# Altium project Segger_TypeC_DebugBoard_v1.PrjPcb
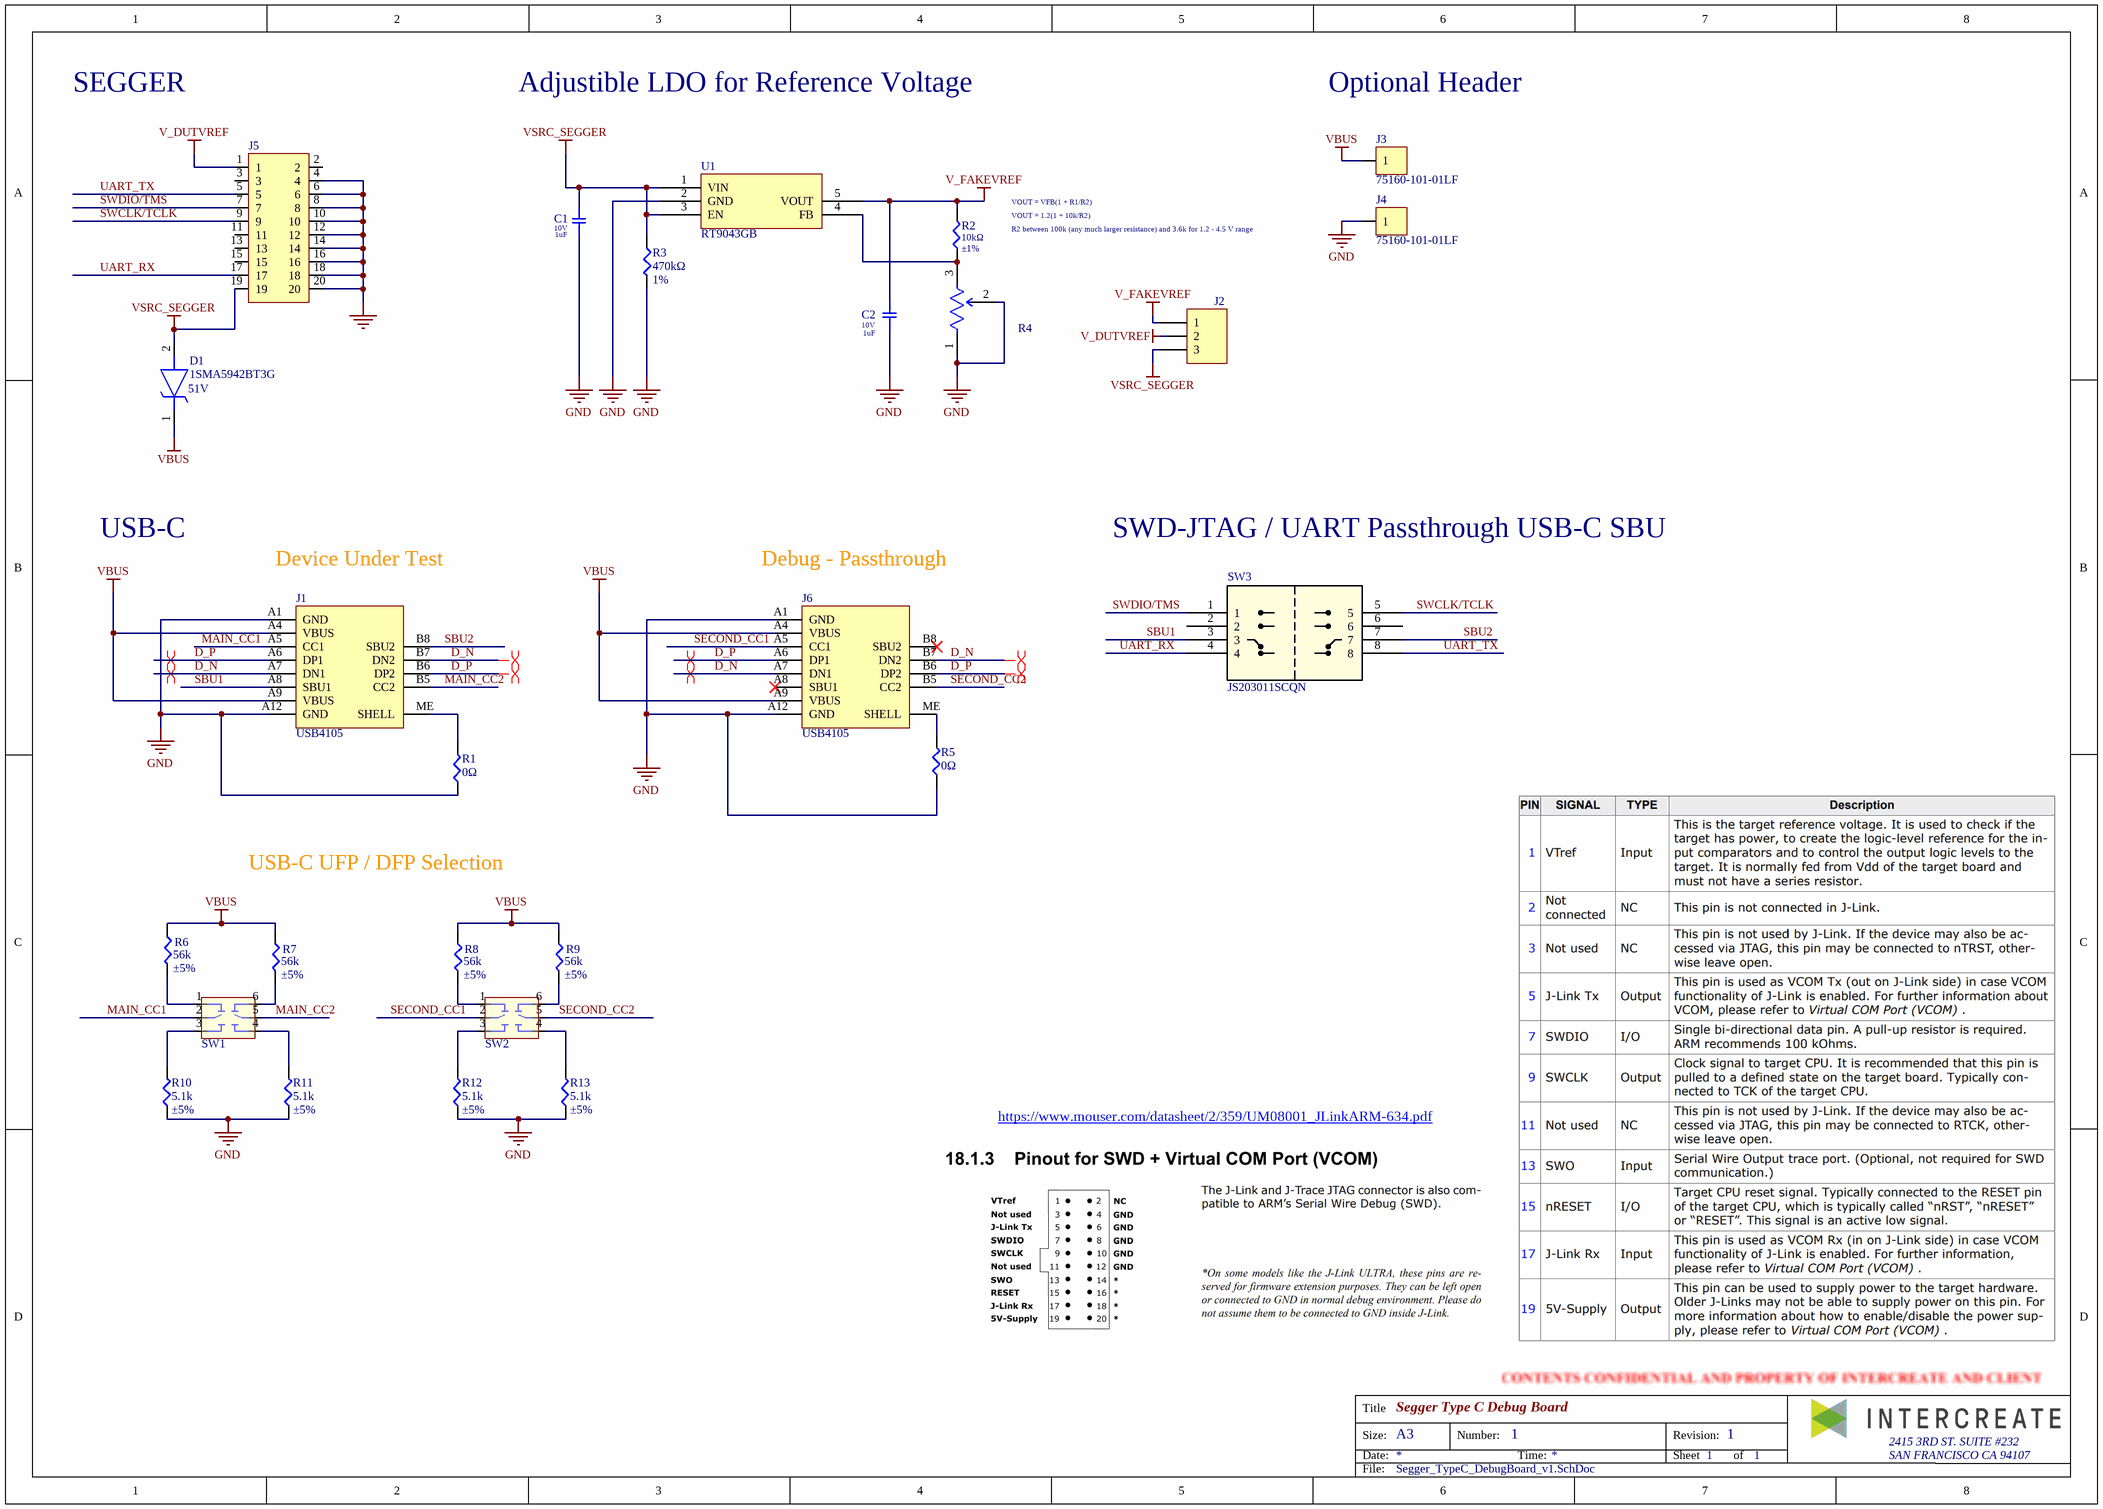
[diagram p0: Segger_TypeC_DebugBoard_v1.SchDoc]
Rev: 1; ProjectName: Segger Type C Debug Board
1 sheet, 26 parts. Net scope: global (net labels, ports and power ports of the same name join across sheets).
Board file: Segger_TypeC_DebugBoard_v1.PcbDoc

## Sheet Segger_TypeC_DebugBoard_v1.SchDoc: Segger Type C Debug Board
size A3; Organization: INTERCREATE; Address1: 2415 3RD ST. SUITE #232; Address2: SAN FRANCISCO CA 94107; DocumentNumber: 1; Revision: 1; SheetNumber: 1; SheetTotal: 1; ProjectName: KAGWERKS COMMAND CENTER

### Parts
C1  Voltage Rating: 10V  Capacitance: 1uF  [CAP-0402]  (hidden comment: 0402ZD105KAT2A)
C2  Voltage Rating: 10V  Capacitance: 1uF  [CAP-0402]  (hidden comment: 0402ZD105KAT2A)
D1  1SMA5942BT3G  Zener Voltage: 51V  [DIODE-SMA2]
J1  USB4105  [CONN-USBC-GCT_USB4105]
J2  61300311121  [HDR-V-1X3]  (value not drawn)
J3  75160-101-01LF  [HDR-V-1X1-M]
J4  75160-101-01LF  [HDR-V-1X1-M]
J5  SFH11-PBPC-D10-ST-BK  [HDR-V-2X10-F-2.54MM]  (value not drawn)
J6  USB4105  [CONN-USBC-GCT_USB4105]
R1  value 0Ω  [RES-0402]  (hidden comment: RC0402FR-070RL)
R2  value 10kΩ  Tolerance: ±1%  [RES-0402]  (hidden comment: RC0402FR-0710KL)
R3  value 470kΩ  Resistance Tolerance: 1%  [RES-0402]  (hidden comment: RC0402FR-07470KL)
R4  POT-ROT-100K-SMD  [3361P-1-104GLF]  (value not drawn)
R5  value 0Ω  [RES-0402]  (hidden comment: RC0402FR-070RL)
R6  value 56k  Tolerance: ±5%  [RES-0402]  (hidden comment: ERJ2GEJ563X)
R7  value 56k  Tolerance: ±5%  [RES-0402]  (hidden comment: ERJ2GEJ563X)
R8  value 56k  Tolerance: ±5%  [RES-0402]  (hidden comment: ERJ2GEJ563X)
R9  value 56k  Tolerance: ±5%  [RES-0402]  (hidden comment: ERJ2GEJ563X)
R10  value 5.1k  Tolerance: ±5%  [RES-0402]  (hidden comment: ERJ2GEJ512X)
R11  value 5.1k  Tolerance: ±5%  [RES-0402]  (hidden comment: ERJ2GEJ512X)
R12  value 5.1k  Tolerance: ±5%  [RES-0402]  (hidden comment: ERJ2GEJ512X)
R13  value 5.1k  Tolerance: ±5%  [RES-0402]  (hidden comment: ERJ2GEJ512X)
SW1  CS-4-22YTA  [SW-BCD-CS-4-22YTA]  (value not drawn)
SW2  CS-4-22YTA  [SW-BCD-CS-4-22YTA]  (value not drawn)
SW3  JS203011SCQN  [SW-2P3T-SMD]
U1  RT9043GB  [SOT-23-5]

### Nets
GND: C1.1 C2.1 J1.A1(GND) J1.A12(GND) J4.1 J5.4 J5.6 J5.8 J5.10 J5.12 J5.14 J5.16 J5.18 J5.20 J6.A1(GND) J6.A12(GND) R1.1 R3.2 R4.1(CCW) R4.2(WIPER) R5.1 R10.1 R11.1 R12.1 R13.1 U1.2(GND)
V_DUTVREF: J2.2 J5.1
V_FAKEVREF: C2.2 J2.1 R2.2 U1.5(VOUT)
VBUS: D1.1(K) J1.A4(VBUS) J1.A9(VBUS) J3.1 J6.A4(VBUS) J6.A9(VBUS) R6.1 R7.1 R8.1 R9.1
VSRC_SEGGER: C1.2 D1.2(A) J2.3 J5.19 R3.1 U1.1(VIN) U1.3(EN)
D_N: J1.A7(DN1) J1.B7(DN2) J6.A7(DN1) J6.B7(DN2)
D_P: J1.A6(DP1) J1.B6(DP2) J6.A6(DP1) J6.B6(DP2)
MAIN_CC1: J1.A5(CC1) SW1.2
MAIN_CC2: J1.B5(CC2) SW1.5
SBU1: J1.A8(SBU1) SW3.3
SBU2: J1.B8(SBU2) SW3.7
SECOND_CC1: J6.A5(CC1) SW2.2
SECOND_CC2: J6.B5(CC2) SW2.5
SWCLK/TCLK: J5.9 SW3.5
SWDIO/TMS: J5.7 SW3.1
UART_RX: J5.17 SW3.4
UART_TX: J5.5 SW3.8
NetJ1_ME: J1.ME(SHELL) R1.2
NetJ6_ME: J6.ME(SHELL) R5.2
NetR2_1: R2.1 R4.3(CW) U1.4(FB)
NetR6_2: R6.2 SW1.1
NetR7_2: R7.2 SW1.6
NetR8_2: R8.2 SW2.1
NetR9_2: R9.2 SW2.6
NetR10_2: R10.2 SW1.3
NetR11_2: R11.2 SW1.4
NetR12_2: R12.2 SW2.3
NetR13_2: R13.2 SW2.4

Not connected (* = marked no-connect by the designer): J5 2 3 11 13 15; J6 A8(SBU1)* B8(SBU2)*; SW3 2 6

### Layout directives
differential pair: D_N, D_P

### Notes on the sheet
- SEGGER
- Adjustible LDO for Reference Voltage
- Optional Header
- VOUT = VFB(1 + R1/R2)
- VOUT = 1.2(1 + 10k/R2)
- R2 between 100k (any much larger resistance) and 3.6k for 1.2 - 4.5 V range
- USB-C
- (near J1) Device Under Test
- (near J6) Debug - Passthrough
- SWD-JTAG / UART Passthrough USB-C SBU
- USB-C UFP / DFP Selection
- https://www.mouser.com/datasheet/2/359/UM08001_JLinkARM-634.pdf
- Title
- Size:
- Date:
- A3
- Number:
- Time:
- Revision:
- Sheet
- of
- File:

### Library data of the parts
C1 C2 = CAP-1uF-10V-0402: AVX - 0402ZD105KAT2A - SMD Multilayer Ceramic Capacitor, 1 µF, 10 V, 0402 [1005 Metric], ± 10%, X5R, AVX 0402 MLCC; Manufacturer 1: Kyocera AVX; Supplier 1: Digi-Key; Manufacturer Part Number 1: 0402ZD105KAT2A; RoHS: Yes; Category: Ceramic Capacitors; Stock 1: 2474650; Pricing 1: 1=0.12000, 10=0.08800, 50=0.05000, 100=0.04140, 500=0.02900, 1000=0.02401, 2500=0.02235, 5000=0.02045 (USD); Mount: Surface Mount; Case/Package: 0402; Case Code (Imperial): 0402; Case Code (Metric): 1005; Dielectric Material: Ceramic; Contact Plating: Tin,Matte; Min Operating Temperature: -55°C; Max Operating Temperature: 85°C; Tolerance: 10%; Dielectric: X5R; Packaging: Cut Tape; Voltage Rating (DC): 10V; Termination: SMD/SMT; Package Quantity: 1; Voltage: 10V; Series: -; Construction: Flat; Length: 1mm; Width: 0.02inch; Height: 0.56mm; Lead Pitch: 5.08mm; Thickness: 0.022inch; Depth: 0.5mm; Radiation Hardening: No; REACH SVHC: No SVHC; Lead Free: Lead Free; RoHS Compliant: Yes; ComponentLink1URL: https://datasheet.ciiva.com/151/cx5r-151901.pdf?src-supplier=Digi-Key; ComponentLink1Description: https://datasheet.ciiva.com/151/cx5r-151901.pdf?src-supplier=Digi-Key; ComponentLink2URL: https://datasheet.ciiva.com/151/cx5r-151902.pdf?src-supplier=Digi-Key; ComponentLink2Description: https://datasheet.ciiva.com/151/cx5r-151902.pdf?src-supplier=Digi-Key; ComponentLink3URL: https://datasheet.ciiva.com/151/cx5r-151903.pdf?src-supplier=Digi-Key; ComponentLink3Description: https://datasheet.ciiva.com/151/cx5r-151903.pdf?src-supplier=Digi-Key; ComponentLink4URL: https://datasheet.ciiva.com/11464/cx5r-11464568.pdf?src-supplier=Avnet; ComponentLink4Description: https://datasheet.ciiva.com/11464/cx5r-11464568.pdf?src-supplier=Avnet; ComponentLink5URL: https://datasheet.ciiva.com/6159/lt-6159749.pdf?src-supplier=Farnell; ComponentLink5Description: https://datasheet.ciiva.com/6159/lt-6159749.pdf?src-supplier=Farnell; ComponentLink6URL: https://datasheet.ciiva.com/1124/1666675-1124066.pdf?src-supplier=Element14; ComponentLink6Description: https://datasheet.ciiva.com/1124/1666675-1124066.pdf?src-supplier=Element14; ComponentLink7URL: https://datasheet.ciiva.com/1124/1666675-1124067.pdf?src-supplier=Element14; ComponentLink7Description: https://datasheet.ciiva.com/1124/1666675-1124067.pdf?src-supplier=Element14; ComponentLink8URL: https://datasheet.ciiva.com/16448/cx5r-16448997.pdf?src-supplier=Future+Electronics; ComponentLink8Description: https://datasheet.ciiva.com/16448/cx5r-16448997.pdf?src-supplier=Future+Electronics; Supplier Part Number 1: 478-4596-1-ND
D1 = DIODE-ZNR-51V-SMA2: Zener Diode 51 V 1.5 W ±5% Surface Mount SMA; Manufacturer 1: onsemi; Impedance (Max): 70 Ohms; Current - Reverse Leakage @ Vr: 500 nA @ 38.8V; Forward Voltage: 1.2V @ 200 mA; Manufacturer Part Number 1: 1SMA5942BT3G; Supplier: Digi-Key; ComponentLink1Description: Supplier Link; ComponentLink1URL: https://www.digikey.com/en/products/detail/onsemi/1SMA5942BT3G/1474755; ComponentLink2Description: Datasheet; ComponentLink2URL: https://www.onsemi.com/pdf/datasheet/1sma5913bt3-d.pdf; Category: Zener
J1 J6 = CONN-F-USB-C-GCT_USB4105: Usb Conn, 2.0 Type C, Rcpt, 16Pos, Smt Rohs Compliant: Yes; Manufacturer 1: Global Connector Technology; Manufacturer Part Number 1: USB4105-GF-A; Supplier 1: Newark; RoHS: No; Stock 1: 1960; Pricing 1: 1=0.85100, 10=0.69300, 25=0.63100, 50=0.58700, 100=0.54000 (USD); Supplier Part Number 1: 86AH2021
J2 = HDR-V-1X3-M: Header, 3-Pin, 0.1"; Manufacturer: Wurth Electronics; Number of Positions: 3; Gender: Male; Connector Type: Male Pin; Pitch: 0.1inch; LatestRevisionDate: 17-Jul-2002; LatestRevisionNote: Re-released for DXP Platform.; Publisher: Altium Limited; Supplier 1: Digi-Key; MPN: 61300311121; Stock 1: 41782; Pricing 1: 1=0.13, 10=0.106, 25=0.088, 50=0.074, 100=0.067, 1000=0.061 (USD); Mount: Through Hole; Contact Plating: Gold; Contact Material: Copper; Colour: Black; Number of Rows: 1; Packaging: Bulk; Termination: Solder; Number of Contacts: 3; Contact Mating Length: 0.236inch; REACH SVHC: Unknown; Lead Free: Lead Free; ComponentLink1URL: http://www.farnell.com/cad/1737268.pdf; ComponentLink1Description: http://www.farnell.com/cad/1737268.pdf; ComponentLink2URL: http://katalog.we-online.de/em/datasheet/6130xx11121.pdf; ComponentLink2Description: http://katalog.we-online.de/em/datasheet/6130xx11121.pdf; Supplier Part Number 1: 732-5316-ND; Manufacturer 1: Wurth Electronics; Manufacturer Part Number 1: 61300311121
J3 J4 = HDR-V-1X1-M: BergStik®, Board to Board connector, Unshrouded vertical header, through hole, single Row, 1 position, 2.54mm pitch; Manufacturer 1: Amphenol ICC / FCI; Current Rating: 3A; Voltage Rating: 1.5kV; Number of Positions: 1; Insulation Resistance: 5GR; Gender: Male; Connector Type: Male Pin; Supplier 1: Mouser; Manufacturer Part Number 1: 75160-101-01LF; RoHS: Yes; Category: Connectors; Stock 1: 4529; Pricing 1: 1=0.36000, 10=0.27000, 50=0.27000, 100=0.21400, 1000=0.16800, 10000=0.12900 (USD); Mounting Technology: Through Hole; Contact Plating: Gold,GXT; Contact Material: Bronze; Color: Black; Housing Color: Black; Housing Material: Thermoplastic; Number of Rows: 1; Package Quantity: 1000; Packaging: Bulk; Contact Gender: Male; Termination: Solder; Number of Contacts: 1; Orientation: Straight; Series: BERGSTIK®, MezzSelect™, Basics+; Contact Type: Male Pin; Length: 2.54mm; Contact Mating Length: 0.225inch; Pitch: 2.54mm; Contact Post Length: 2.54mm; Depth: 2.8mm; Radiation Hardening: No; ComponentLink1URL: https://datasheet.ciiva.com/29149/75160-29149349.pdf?src-supplier=Digi-Key; ComponentLink1Description: https://datasheet.ciiva.com/29149/75160-29149349.pdf?src-supplier=Digi-Key; Supplier Part Number 1: 649-75160-101-01LF
J5 = HDR-V-2X10-F-2.54MM: 20 Position Header Connector 0.100" (2.54mm) Through Hole Gold; Manufacturer 1: Sullins; Number of Positions: 20; Pitch: 0.1inch; Supplier 1: Digi-Key; Manufacturer Part Number 1: SFH11-PBPC-D10-ST-BK; RoHS: Yes; Category: Headers and Wire Housings; Stock 1: 51703; Pricing 1: 1=1.15000, 10=0.96800, 80=0.86925, 440=0.71118, 1000=0.63216, 5000=0.57070 (USD); Mount: Through Hole; Color: Black; Contact Plating: Gold; Package Quantity: 1; Number of Rows: 2; Packaging: Tray; Termination: Solder; Connector Type: Header; Series: SFH11; Contact Type: Female Socket; Row Spacing: 0.1inch; Lead Free: Lead Free; RoHS Compliant: Yes; ComponentLink1URL: https://datasheet.ciiva.com/754/sfh11-pxxc-dxx-st-xx11160-c-754558.pdf?src-supplier=Digi-Key; ComponentLink1Description: https://datasheet.ciiva.com/754/sfh11-pxxc-dxx-st-xx11160-c-754558.pdf?src-supplier=Digi-Key; Supplier Part Number 1: S9197-ND
R1 R5 = RES-0-0402: RES 0 OHM JUMPER 1/16W 0402; Manufacturer: Yageo; Rated Power Dissipation (P): 62.5mW; Rated Temperature: 70°C; Resistance: 0R; Supplier 1: Digi-Key; Manufacturer Part Number: RC0402FR-070RL; RoHS: Yes; Category: Chip SMD Resistors; Stock 1: 2669862; Pricing 1: 10000=0.00132, 30000=0.00116, 50000=0.00109 (USD); Mount: Surface Mount; Number of Pins: 2; Package Shape: Rectangular; Size Code: 0402; Terminal Finish: Nickel; Min Operating Temperature: -55°C; Max Operating Temperature: 155°C; JESD-609 Code: e3; Resistor Type: FIXED RESISTOR; Packaging: Tape and Reel; Technology: METAL GLAZE/THICK FILM; Termination: Wraparound; REACH SVHC: Yes; RoHS Compliant: Yes; ComponentLink1URL: https://datasheet.ciiva.com:443/pdfs/VipMasterIC/IC/YAGO/YAGOS02562/YAGOS02562-1.pdf?src-supplier=IHS+Markit; ComponentLink1Description: https://datasheet.ciiva.com:443/pdfs/VipMasterIC/IC/YAGO/YAGOS02562/YAGOS02562-1.pdf?src-supplier=IHS+Markit; ComponentLink2URL: https://datasheet.ciiva.com/8896/pyu-rc0402-51-rohs-l-6-8896149.pdf?src-supplier=Avnet; ComponentLink2Description: https://datasheet.ciiva.com/8896/pyu-rc0402-51-rohs-l-6-8896149.pdf?src-supplier=Avnet; ComponentLink3URL: https://datasheet.ciiva.com/16790/pyu-rc0402-51-rohs-l-6-r-16790444.pdf?src-supplier=Future+Electronics; ComponentLink3Description: https://datasheet.ciiva.com/16790/pyu-rc0402-51-rohs-l-6-r-16790444.pdf?src-supplier=Future+Electronics; ComponentLink4URL: https://datasheet.ciiva.com/28419/pyu-rc0402-51-rohs-l-6-28419661.pdf?src-supplier=Avnet+Europe; ComponentLink4Description: https://datasheet.ciiva.com/28419/pyu-rc0402-51-rohs-l-6-28419661.pdf?src-supplier=Avnet+Europe; ComponentLink5URL: https://datasheet.ciiva.com/16869/pyu-rc0402-51-rohs-l-6-16869518.pdf?src-supplier=Avnet+Europe; ComponentLink5Description: https://datasheet.ciiva.com/16869/pyu-rc0402-51-rohs-l-6-16869518.pdf?src-supplier=Avnet+Europe; Manufacturer 1: Yageo; Manufacturer Part Number 1: RC0402FR-070RL; Supplier Part Number 1: 311-0.0LRTR-ND; Tolerance: Jumper; Manufacturer_PN: RC0402FR-070RL
R2 = RES-10K-0402: RES SMD 10K OHM 1% 1/16W 0402; Manufacturer 1: Yageo; Resistance: 10kR; Temperature Coefficient: 100ppm/°C; Voltage Rating (DC): 50V; Power Rating: 62.5mW; Supplier 1: Digi-Key; Manufacturer Part Number 1: RC0402FR-0710KL; Stock 1: 64327699; Pricing 1: 1=0.10000, 10=0.01500, 100=0.00600, 1000=0.00270, 2500=0.00235, 5000=0.00194 (USD); RoHS: Yes; Case/Package: 0402; Number of Pins: 2; Case Code (Imperial): 0402; Case Code (Metric): 1005; Min Operating Temperature: -55°C; Max Operating Temperature: 155°C; Composition: Thick Film; Packaging: Tape and Reel; Voltage Rating: 50V; Termination: SMD/SMT; Military Standard: Not; Working Voltage: 50V; Number of Terminations: 2; Length: 1mm; Height: 0.32mm; Width: 0.5mm; Depth: 0.5mm; Lead Pitch: 0.2mm; REACH SVHC: No SVHC; Lead Free: Lead Free; ComponentLink1URL: https://datasheet.ciiva.com/7660/38568-7660787.pdf?src-supplier=Element14; ComponentLink1Description: https://datasheet.ciiva.com/7660/38568-7660787.pdf?src-supplier=Element14; ComponentLink2URL: https://datasheet.ciiva.com/7849/1784430-7849813.pdf?src-supplier=Element14; ComponentLink2Description: https://datasheet.ciiva.com/7849/1784430-7849813.pdf?src-supplier=Element14; ComponentLink3URL: https://datasheet.ciiva.com/7849/1686128-7849814.pdf?src-supplier=Element14; ComponentLink3Description: https://datasheet.ciiva.com/7849/1686128-7849814.pdf?src-supplier=Element14; ComponentLink4URL: https://datasheet.ciiva.com/7849/1784430-7849815.pdf?src-supplier=Element14; ComponentLink4Description: https://datasheet.ciiva.com/7849/1784430-7849815.pdf?src-supplier=Element14; ComponentLink5URL: https://datasheet.ciiva.com/22747/1018594-22747512.pdf?src-supplier=Element14; ComponentLink5Description: https://datasheet.ciiva.com/22747/1018594-22747512.pdf?src-supplier=Element14; ComponentLink6URL: https://datasheet.ciiva.com/12667/pyu-rc0402-51-rohs-l-6-r-12667067.pdf?src-supplier=Mouser; ComponentLink6Description: https://datasheet.ciiva.com/12667/pyu-rc0402-51-rohs-l-6-r-12667067.pdf?src-supplier=Mouser; ComponentLink7URL: https://datasheet.ciiva.com/7983/1018594-7983486.pdf?src-supplier=Element14; ComponentLink7Description: https://datasheet.ciiva.com/7983/1018594-7983486.pdf?src-supplier=Element14; Supplier Part Number 1: 311-10.0KLRCT-ND
R3 = RES-470K-0402: RES SMD 470K OHM 1% 1/16W 0402; Manufacturer 1: Yageo; Resistance: 470kR; Power Rating: 62.5mW; Voltage Rating: 50V; Temperature Coefficient: 100ppm/°C; Max Power Dissipation: 63mW; Supplier 1: Digi-Key; Manufacturer Part Number 1: RC0402FR-07470KL; RoHS: Yes; Category: Chip SMD Resistors; Stock 1: 112236; Pricing 1: 1=0.10000, 10=0.01600, 100=0.00660, 1000=0.00299, 2500=0.00259, 5000=0.00214 (USD); Case/Package: 0402; Number of Pins: 2; Case Code (Imperial): 0402; Case Code (Metric): 1005; Size Code: 0402; Min Operating Temperature: -55°C; Max Operating Temperature: 155°C; Tolerance: 1%; Packaging: Tape and Reel; Voltage Rating (DC): 50V; Package Quantity: 1; Termination: SMD/SMT; Resistor Type: Thick Film; Number of Terminations: 2; Features: Moisture Resistant; Series: RC; Construction: Rectangular; Technology: THICK FILM; Length: 1mm; Width: 0.02inch; Height: 0.016inch; Depth: 0.5mm; RoHS Compliant: Yes; REACH SVHC: No SVHC; Military Standard: Not; Lead Free: Lead Free; ComponentLink1URL: https://datasheet.ciiva.com/11819/0900766b80c66297-11819514.pdf?src-supplier=RSComponents; ComponentLink1Description: https://datasheet.ciiva.com/11819/0900766b80c66297-11819514.pdf?src-supplier=RSComponents; ComponentLink2URL: https://datasheet.ciiva.com/2453/pyu-r-int-thick-7-2453433.pdf?src-supplier=Digi-Key; ComponentLink2Description: https://datasheet.ciiva.com/2453/pyu-r-int-thick-7-2453433.pdf?src-supplier=Digi-Key; ComponentLink3URL: https://datasheet.ciiva.com/2453/pyu-r-int-thick-7-2453434.pdf?src-supplier=Digi-Key; ComponentLink3Description: https://datasheet.ciiva.com/2453/pyu-r-int-thick-7-2453434.pdf?src-supplier=Digi-Key; ComponentLink4URL: https://datasheet.ciiva.com/2453/pyu-r-int-thick-7-2453435.pdf?src-supplier=Digi-Key; ComponentLink4Description: https://datasheet.ciiva.com/2453/pyu-r-int-thick-7-2453435.pdf?src-supplier=Digi-Key; ComponentLink5URL: https://datasheet.ciiva.com/15189/getdatasheetpartid-325138-15189462.pdf?src-supplier=Verical; ComponentLink5Description: https://datasheet.ciiva.com/15189/getdatasheetpartid-325138-15189462.pdf?src-supplier=Verical; ComponentLink6URL: https://datasheet.ciiva.com/46412/1018594-46412837.pdf?src-supplier=Element14; ComponentLink6Description: https://datasheet.ciiva.com/46412/1018594-46412837.pdf?src-supplier=Element14; ComponentLink7URL: https://datasheet.ciiva.com/7850/1018594-7850012.pdf?src-supplier=Element14; ComponentLink7Description: https://datasheet.ciiva.com/7850/1018594-7850012.pdf?src-supplier=Element14; ComponentLink8URL: https://datasheet.ciiva.com/7850/1018594-7850013.pdf?src-supplier=Element14; ComponentLink8Description: https://datasheet.ciiva.com/7850/1018594-7850013.pdf?src-supplier=Element14; Supplier Part Number 1: 311-470KLRCT-ND
R4 = POT-ROT-100K-SMD: TRIMMER 100K OHM 0.5W GW TOP ADJ; Manufacturer 1: Bourns Inc.; Manufacturer Part Number 1: 3361P-1-104GLF; ComponentLink1Description: Datasheet; ComponentLink1URL: https://www.bourns.com/docs/Product-Datasheets/3361.pdf
R6-R9 = RES-56K-0402-5%: RES SMD 56K OHM 5% 1/10W 0402; Manufacturer 1: Panasonic; Power Rating: 100mW; Resistance: 56kR; Voltage Rating: 50V; Temperature Coefficient: 200ppm/°C; Supplier 1: Digi-Key; Manufacturer Part Number 1: ERJ2GEJ563X; Stock 1: 167786; Pricing 1: 1 = 0.10000, 10 = 0.03100, 100 = 0.01250, 1000 = 0.00560, 2500 = 0.00486, 5000 = 0.00401 (USD); RoHS: Yes; Mount: Surface Mount; Case/Package: 0402; Weight: 2.8E-05oz; Case Code (Imperial): 0402; Case Code (Metric): 1005; Contact Plating: Tin; Min Operating Temperature: -55°C; Max Operating Temperature: 155°C; Packaging: Tape and Reel; Package Quantity: 10000; Composition: Thick Film; Termination: SMD/SMT; Number of Terminations: 2; Military Standard: Not; Max Power Dissipation: 100mW; Voltage Rating (DC): 50V; Length: 1mm; Height: 0.35mm; Width: 0.5mm; Depth: 0.5mm; REACH SVHC: No SVHC; Lead Free: Lead Free; ComponentLink1URL: https://datasheet.ciiva.com/11821/0900766b80f806dd-11821353.pdf?src-supplier=RSComponents; ComponentLink1Description: https://datasheet.ciiva.com/11821/0900766b80f806dd-11821353.pdf?src-supplier=RSComponents; ComponentLink2URL: https://datasheet.ciiva.com/46377/1500035-46377371.pdf?src-supplier=Element14; ComponentLink2Description: https://datasheet.ciiva.com/46377/1500035-46377371.pdf?src-supplier=Element14; ComponentLink3URL: https://datasheet.ciiva.com/46389/1500035-46389069.pdf?src-supplier=Element14; ComponentLink3Description: https://datasheet.ciiva.com/46389/1500035-46389069.pdf?src-supplier=Element14; ComponentLink4URL: https://datasheet.ciiva.com/30184/4aoa0000ce1-30184118.pdf?src-supplier=Onlinecomponents.com; ComponentLink4Description: https://datasheet.ciiva.com/30184/4aoa0000ce1-30184118.pdf?src-supplier=Onlinecomponents.com; ComponentLink5URL: https://datasheet.ciiva.com/24159/aoa0000ce1-37422-24159031.pdf?src-supplier=Mouser; ComponentLink5Description: https://datasheet.ciiva.com/24159/aoa0000ce1-37422-24159031.pdf?src-supplier=Mouser; ComponentLink6URL: https://datasheet.ciiva.com/9188/aoa0000ce1-9188716.pdf?src-supplier=Avnet; ComponentLink6Description: https://datasheet.ciiva.com/9188/aoa0000ce1-9188716.pdf?src-supplier=Avnet; ComponentLink7URL: https://datasheet.ciiva.com/16769/70260739-16769566.pdf?src-supplier=Allied+Electronics; ComponentLink7Description: https://datasheet.ciiva.com/16769/70260739-16769566.pdf?src-supplier=Allied+Electronics; ComponentLink8URL: https://datasheet.ciiva.com/43460/1500035-43460399.pdf?src-supplier=Farnell; ComponentLink8Description: https://datasheet.ciiva.com/43460/1500035-43460399.pdf?src-supplier=Farnell; Supplier Part Number 1: P56KJCT-ND
R10-R13 = RES-5.1K-0402: RES SMD 5.1K OHM 5% 1/10W 0402; Manufacturer 1: Panasonic; Resistance: 5.1kR; Power Rating: 100mW; Voltage Rating: 50V; Temperature Coefficient: 200ppm/°C; Supplier 1: Digi-Key; Manufacturer Part Number 1: ERJ2GEJ512X; Stock 1: 1595873; Pricing 1: 1 = 0.10000, 10 = 0.03600, 100 = 0.01480, 1000 = 0.00665, 2500 = 0.00577, 5000 = 0.00477 (USD); RoHS: Yes; Mount: Surface Mount; Case/Package: 0402; Case Code (Metric): 1005; Case Code (Imperial): 0402; Contact Plating: Tin; Min Operating Temperature: -55°C; Max Operating Temperature: 155°C; Packaging: Tape and Reel; Package Quantity: 1; Composition: Thick Film; Number of Terminations: 2; Termination: SMD/SMT; Military Standard: Not; Max Power Dissipation: 100mW; Voltage Rating (DC): 50V; Length: 1mm; Height: 0.35mm; Width: 0.02inch; Depth: 0.5mm; Radiation Hardening: No; REACH SVHC: No SVHC; Lead Free: Lead Free; ComponentLink1URL: https://datasheet.ciiva.com/11821/0900766b80f806dd-11821350.pdf?src-supplier=RSComponents; ComponentLink1Description: https://datasheet.ciiva.com/11821/0900766b80f806dd-11821350.pdf?src-supplier=RSComponents; ComponentLink2URL: https://datasheet.ciiva.com/9195/aoa0000ce1-9195574.pdf?src-supplier=Avnet; ComponentLink2Description: https://datasheet.ciiva.com/9195/aoa0000ce1-9195574.pdf?src-supplier=Avnet; ComponentLink3URL: https://datasheet.ciiva.com/16768/70260739-16768840.pdf?src-supplier=Allied+Electronics; ComponentLink3Description: https://datasheet.ciiva.com/16768/70260739-16768840.pdf?src-supplier=Allied+Electronics; ComponentLink4URL: https://datasheet.ciiva.com/46377/1500035-46377372.pdf?src-supplier=Element14; ComponentLink4Description: https://datasheet.ciiva.com/46377/1500035-46377372.pdf?src-supplier=Element14; ComponentLink5URL: https://datasheet.ciiva.com/46389/1500035-46389068.pdf?src-supplier=Element14; ComponentLink5Description: https://datasheet.ciiva.com/46389/1500035-46389068.pdf?src-supplier=Element14; ComponentLink6URL: https://datasheet.ciiva.com/30141/4aoa0000ce1-30141421.pdf?src-supplier=Onlinecomponents.com; ComponentLink6Description: https://datasheet.ciiva.com/30141/4aoa0000ce1-30141421.pdf?src-supplier=Onlinecomponents.com; Supplier Part Number 1: P5.1KJCT-ND
SW1 SW2 = SW-DPDT-3P-ROTARY: SWITCH ROTARY DIP DPDT 100MA 16V; Manufacturer: Nidec Copal; Number of Positions: 2; Electrical Life: 200Cycles; Pitch: 0.051inch; Washable: Yes; Supplier 1: Digi-Key; MPN: CS-4-22YTA; Stock 1: 0; Mount: Surface Mount; Contact Material: Copper Alloy; Contact Plating: Gold; Min Operating Temperature: -25°C; Max Operating Temperature: 70°C; Voltage Rating (DC): 16V; Throw Configuration: DPDT; Max Current Rating: 100mA; Packaging: Tape and Reel; Current Rating: 100mA; Termination: J-Hook; Max Voltage Rating (DC): 16V; Orientation: Vertical; Length: 0.197inch; Height: 2.3mm; Width: 4.5mm; Lead Free: Lead Free; ComponentLink1URL: https://datasheet.ciiva.com/2863/cs-4-2863719.pdf; ComponentLink1Description: https://datasheet.ciiva.com/2863/cs-4-2863719.pdf; ComponentLink2URL: https://datasheet.ciiva.com/2863/cs-4-2863720.pdf; ComponentLink2Description: https://datasheet.ciiva.com/2863/cs-4-2863720.pdf; ComponentLink3URL: https://datasheet.ciiva.com/2863/cs-4-2863721.pdf; ComponentLink3Description: https://datasheet.ciiva.com/2863/cs-4-2863721.pdf; Supplier Part Number 1: 563-1039-1-ND; Manufacturer 1: Nidec Copal; Manufacturer Part Number 1: CS-4-22YTA
SW3 = SW-2P3T-SMD: SWITCH SLIDE DP3T 300MA 6V; Manufacturer 1: C&K; Supplier: Digi-Key; ComponentLink1Description: Supplier Link; ComponentLink1URL: https://www.digikey.com/en/products/detail/c-k/JS203011SCQN/7056055; ComponentLink2Description: Datasheet; ComponentLink2URL: https://www.ckswitches.com/media/1422/js.pdf; Manufacturer Part Number 1: JS203011SCQN
U1 = IC-PWR-LDO-RT9043GB: IC REG LINEAR 3.3V 400mA SOT23-5; Manufacturer 1: Richtek USA Inc.; ComponentLink1Description: Datasheet; ComponentLink1URL: https://datasheet.ciiva.com/2046/3d3futf-83fb3frfm5mdqzltaylnbkzg3d3d3f3d-2046897.pdf?src-supplier=Digikey; Manufacturer Part Number 1: RT9043GB

## Assembly variants
Mfg: all parts fitted